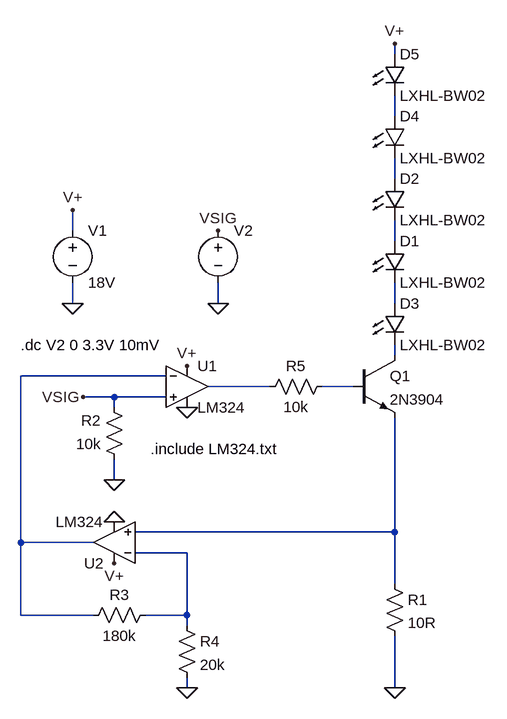
[diagram p0: schematic driver_option3.asc]
driver_option3.asc, the LTspice schematic file:
Version 4
SHEET 1 1380 724
WIRE 512 -496 512 -512
WIRE 512 -400 512 -432
WIRE 512 -304 512 -336
WIRE 16 -224 16 -256
WIRE 512 -208 512 -240
WIRE 16 -112 16 -144
WIRE 240 -112 240 -144
WIRE 512 -112 512 -144
WIRE 512 -32 512 -48
WIRE 160 0 -64 0
WIRE 320 16 224 16
WIRE 448 16 400 16
WIRE 80 32 32 32
WIRE 160 32 80 32
WIRE 80 48 80 32
WIRE 80 160 80 128
WIRE 512 240 512 64
WIRE 512 240 112 240
WIRE -64 256 -64 0
WIRE 48 256 -64 256
WIRE 192 272 112 272
WIRE 512 320 512 240
WIRE -64 368 -64 256
WIRE 48 368 -64 368
WIRE 192 368 192 272
WIRE 192 368 128 368
WIRE 192 384 192 368
WIRE 192 480 192 464
WIRE 512 480 512 400
FLAG 16 -112 0
FLAG 16 -256 V+
FLAG 192 -16 V+
FLAG 192 48 0
FLAG 512 480 0
FLAG 32 32 VSIG
FLAG 80 160 0
FLAG 240 -112 0
FLAG 240 -224 VSIG
FLAG 192 480 0
FLAG 80 288 V+
FLAG 80 224 0
FLAG 512 -512 V+
SYMBOL voltage 16 -240 R0
WINDOW 123 0 0 Left 2
WINDOW 39 0 0 Left 2
SYMATTR InstName V1
SYMATTR Value 18V
SYMBOL npn 448 -32 R0
SYMATTR InstName Q1
SYMATTR Value 2N3904
SYMBOL res 496 304 R0
SYMATTR InstName R1
SYMATTR Value 10R
SYMBOL res 96 144 R180
WINDOW 0 36 76 Left 2
WINDOW 3 36 40 Left 2
SYMATTR InstName R2
SYMATTR Value 10k
SYMBOL voltage 240 -240 R0
WINDOW 123 0 0 Left 2
WINDOW 39 0 0 Left 2
SYMATTR InstName V2
SYMATTR Value ""
SYMBOL Opamps\\opamp2 80 320 R180
SYMATTR InstName U2
SYMATTR Value LM324
SYMBOL res 32 384 R270
WINDOW 0 32 56 VTop 2
WINDOW 3 0 56 VBottom 2
SYMATTR InstName R3
SYMATTR Value 180k
SYMBOL res 176 368 R0
SYMATTR InstName R4
SYMATTR Value 20k
SYMBOL Opamps\\opamp2 192 -48 R0
SYMATTR InstName U1
SYMATTR Value LM324
SYMBOL res 416 0 R90
WINDOW 0 0 56 VBottom 2
WINDOW 3 32 56 VTop 2
SYMATTR InstName R5
SYMATTR Value 10k
SYMBOL LED 496 -304 R0
SYMATTR InstName D2
SYMATTR Value LXHL-BW02
SYMATTR Description Diode
SYMATTR Type diode
SYMBOL LED 496 -208 R0
SYMATTR InstName D1
SYMATTR Value LXHL-BW02
SYMATTR Description Diode
SYMATTR Type diode
SYMBOL LED 496 -112 R0
SYMATTR InstName D3
SYMATTR Value LXHL-BW02
SYMATTR Description Diode
SYMATTR Type diode
SYMBOL LED 496 -400 R0
SYMATTR InstName D4
SYMATTR Value LXHL-BW02
SYMATTR Description Diode
SYMATTR Type diode
SYMBOL LED 496 -496 R0
SYMATTR InstName D5
SYMATTR Value LXHL-BW02
SYMATTR Description Diode
SYMATTR Type diode
TEXT 136 112 Left 2 !.include LM324.txt
TEXT -64 -48 Left 2 !.dc V2 0 3.3V 10mV

The netlist it stands for:
* driver_option3.asc
V1 V+ 0 18V
Q1 N005 N008 N009 0 2N3904
R1 N009 0 10R
R2 0 VSIG 10k
V2 VSIG 0
XU2 N009 N010 V+ 0 N006 LM324  ; pins In+ In- V+ V- OUT
R3 N006 N010 180k
R4 N010 0 20k
XU1 VSIG N006 V+ 0 N007 LM324  ; pins In+ In- V+ V- OUT
R5 N008 N007 10k
D2 N002 N003 LXHL-BW02
D1 N003 N004 LXHL-BW02
D3 N004 N005 LXHL-BW02
D4 N001 N002 LXHL-BW02
D5 V+ N001 LXHL-BW02
.model D D
.lib standard.dio
.model NPN NPN
.model PNP PNP
.lib standard.bjt
.include LM324.txt
.dc V2 0 3.3V 10mV
.backanno
.end